# EAGLE design gps-harness (EAGLE 9.5.1)
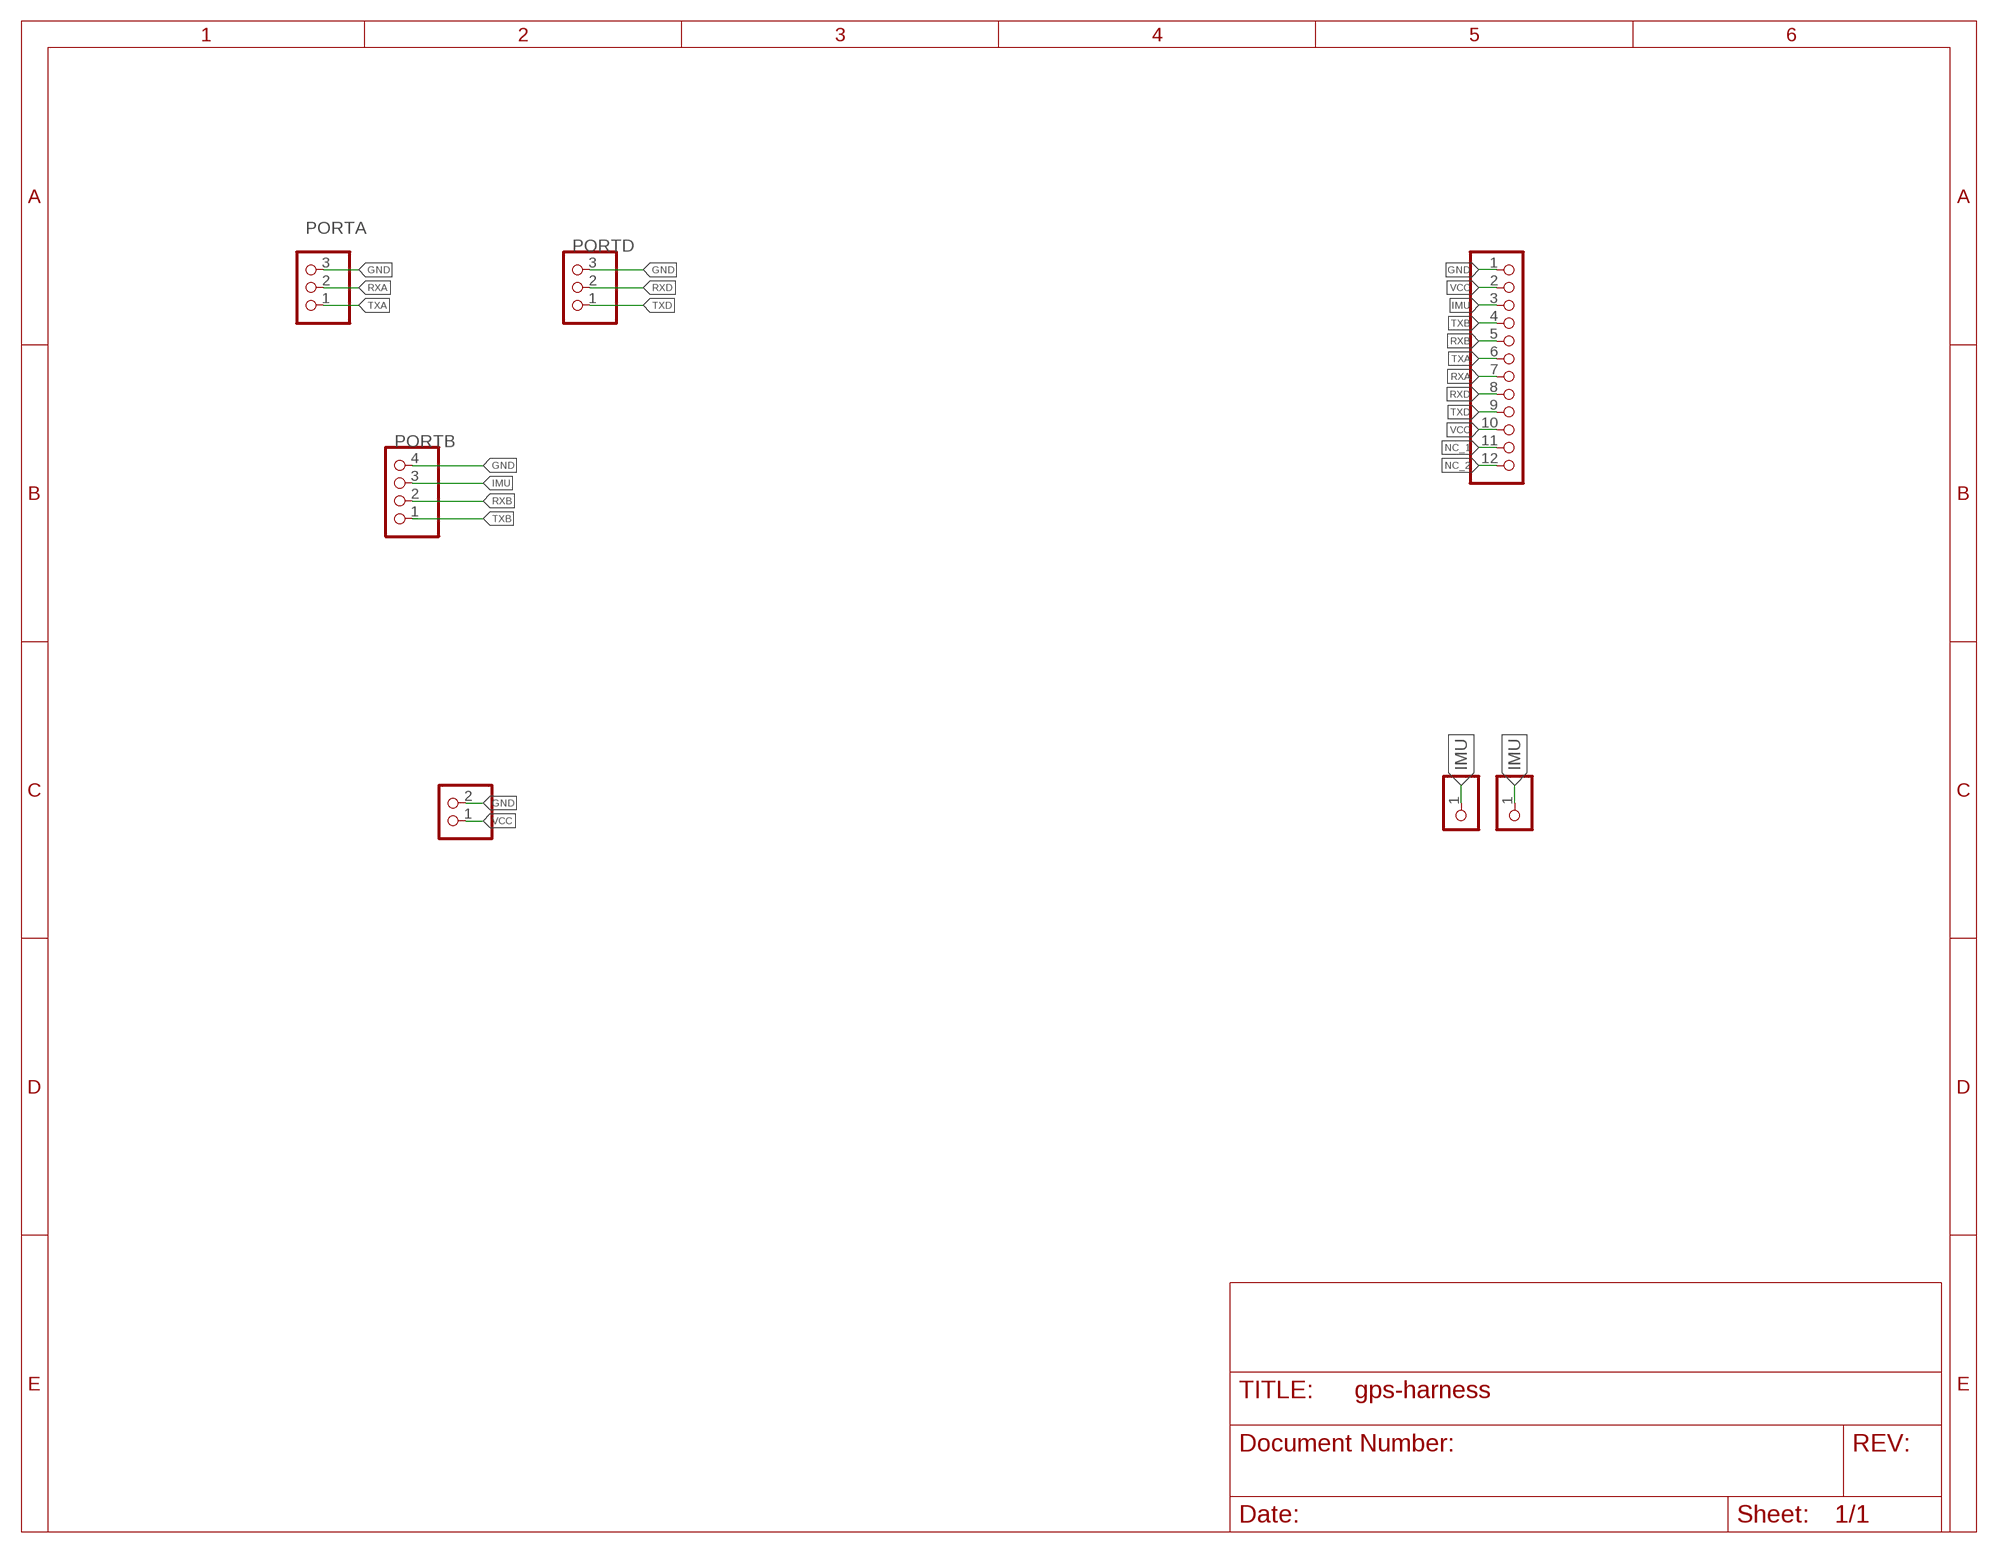
[diagram p0: schematic, sheet 1]

## Parts
BATTERY  PINHD-1X2  [1X02]
GPIO  PINHD-1X12  [1X12]
IMU  PINHD-1X1  [1X01]
PORTA  PINHD-1X3  [1X03]
PORTB  PINHD-1X4  [1X04]
PORTD  PINHD-1X3  [1X03]
TSY  PINHD-1X1  [1X01]

## Nets
GND: BATTERY.2 GPIO.1 PORTA.3 PORTB.4 PORTD.3
IMU: GPIO.3 IMU.1 PORTB.3 TSY.1
NC_1: GPIO.11
NC_2: GPIO.12
RXA: GPIO.7 PORTA.2
RXB: GPIO.5 PORTB.2
RXD: GPIO.8 PORTD.2
TXA: GPIO.6 PORTA.1
TXB: GPIO.4 PORTB.1
TXD: GPIO.9 PORTD.1
VCC: BATTERY.1 GPIO.2 GPIO.10

## Notes on the sheet
- PORTA
- PORTD
- PORTB

## Library data of the parts
BATTERY = pinhead:PINHD-1X2: PIN HEADER
GPIO = pinhead:PINHD-1X12: PIN HEADER
IMU TSY = pinhead:PINHD-1X1: PIN HEADER
PORTA PORTD = pinhead:PINHD-1X3: PIN HEADER
PORTB = pinhead:PINHD-1X4: PIN HEADER

## Board
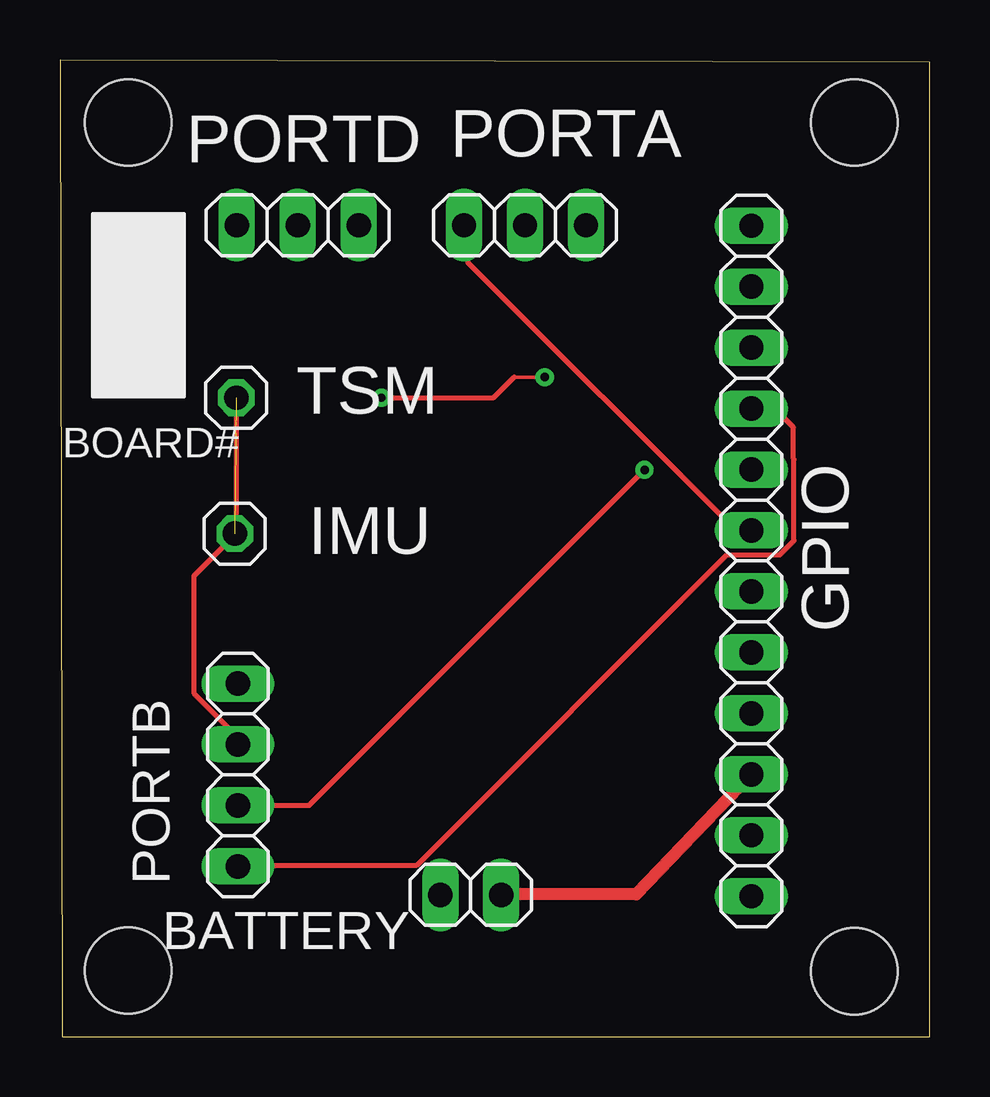
[diagram p1: board, top side]
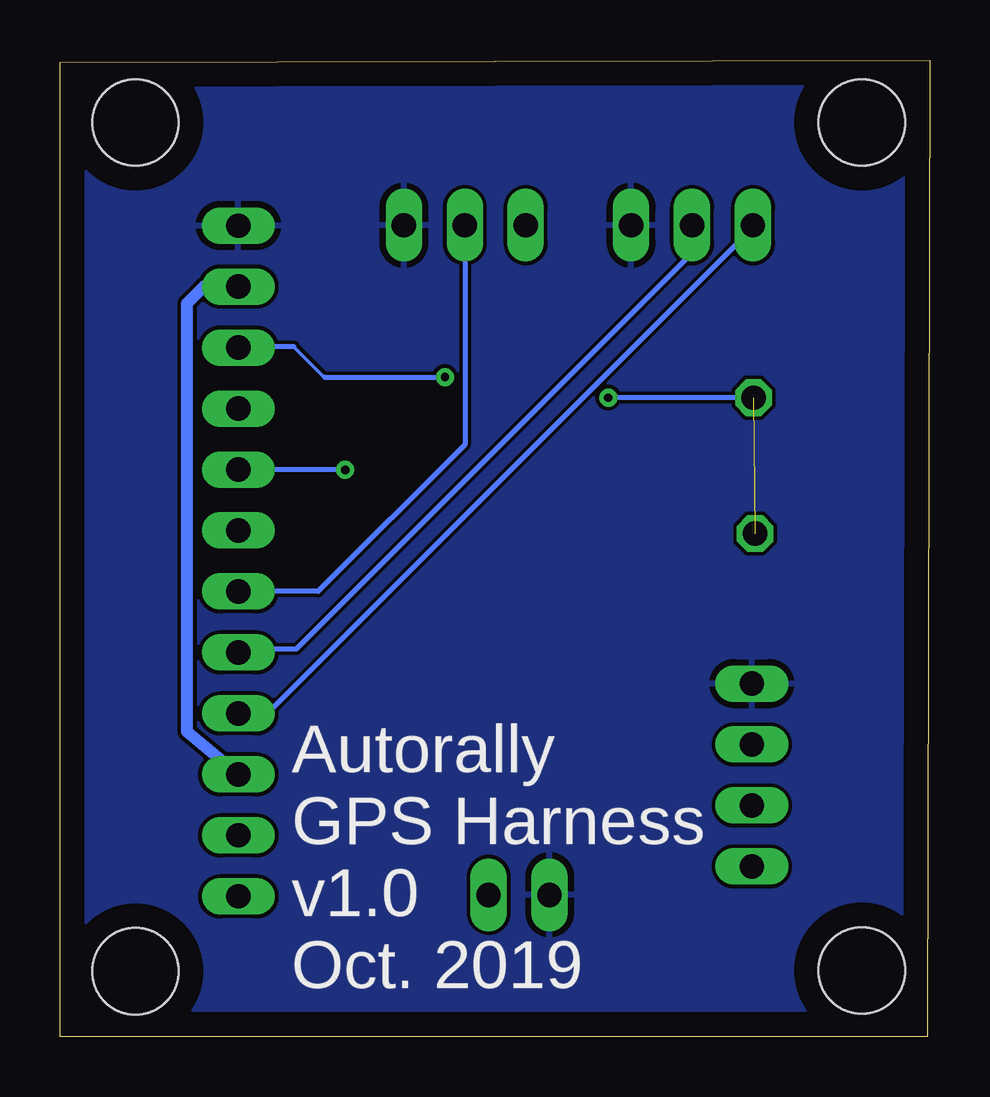
[diagram p2: board, bottom side, seen from below]

Size 36.26 x 40.71 mm. Coordinates in mm from the lower left corner, seen from the top.
Outline: 0.1,0 36.25,0.01 36.26,40.62 0,40.71 0.1,0
Copper layers (1*16): Top 0.035mm / dielectric 1.5mm / Bottom 0.035mm
Design rules "default": minimum track width 6mil, minimum drill 0.35mm, track to track 6mil, track to pad 6mil, pad to pad 6mil, via to via 6mil, smd to smd 6mil, copper to edge 40mil, drill to drill 6mil, minimum pad ring 10mil, minimum via ring 8mil, stop-mask expansion 4mil, vias tented up to drill 0mil, thermal gap 10mil
Holes 3.6 mm at 2.84,38.1 33.12,2.74 2.84,2.77 33.12,38.1

### Footprints (pad centres in the part's own frame; a part is rotated, then mirrored left to right if it is on the bottom)
1X02 = drill 1.016 long: 1 -1.27,0; 2 1.27,0
1X12 = drill 1.016 long: 1 -13.97,0; 2 -11.43,0; 3 -8.89,0; 4 -6.35,0; 5 -3.81,0; 6 -1.27,0; 7 1.27,0; 8 3.81,0; 9 6.35,0; 10 8.89,0; 11 11.43,0; 12 13.97,0
1X01 = drill 1.016 octagon: 1 0,0
1X03 = drill 1.016 long: 1 -2.54,0; 2 0,0; 3 2.54,0
1X04 = drill 1.016 long: 1 -3.81,0; 2 -1.27,0; 3 1.27,0; 4 3.81,0

### Placement (x,y rotation side)
BATTERY  17.12,5.92 180 top
GPIO  28.82,19.83 270 top
IMU  7.35,26.63 0 top
PORTA  19.39,33.82 0 top
PORTB  7.42,10.92 90 top
PORTD  9.91,33.82 0 top
TSY  7.28,20.97 0 top

### Tracks (layer width: path | path; a pad name or v marks a point on that pad's centre or on a via)
GND
  Bottom 0.152: 12.59,33.83 PORTD.3 | 21.89,33.83 PORTA.3 22.04,33.83 | 28.7,33.83 GPIO.1
  Bottom 0.5: PORTB.4 7.57,14.73
  pour Bottom: -1.17,41.91 -1.17,-1.27 38.2,-1.27 38.2,41.91
IMU  (via drill 0.35)  (1 unrouted)
  Top 0.152: 7.41,12.5 PORTB.3 | 18.94,27.49 v20.21,27.49
  Top 0.203: 7.41,12.5 5.58,14.33 5.58,19.2 7.35,20.97 IMU.1 | v13.4,26.63 18.08,26.63 18.94,27.49
  Bottom 0.152: v13.4,26.63 | 25.25,27.49 26.52,28.76 | 28.78,28.76 GPIO.3
  Bottom 0.203: IMU.1 v13.4,26.63 | 25.25,27.49 v20.21,27.49 | 26.52,28.76 28.78,28.76
RXA
  Bottom 0.203: PORTA.2 19.39,24.67 25.49,18.56 GPIO.7
RXB  (via drill 0.35)
  Top 0.152: v24.37,23.63 | v24.37,23.63
  Top 0.203: PORTB.2 10.39,9.65 v24.37,23.63
  Bottom 0.152: 28.81,23.63 GPIO.5
  Bottom 0.203: v24.37,23.63 28.81,23.63
RXD
  Bottom 0.152: 28.7,16.15 GPIO.8 | 9.91,32.65 PORTD.2
  Bottom 0.203: 28.7,16.15 26.41,16.15 9.91,32.65
TXA
  Top 0.203: GPIO.6 28.17,21.1 17.01,32.26 PORTA.1
TXB
  Top 0.152: 7.56,7.16 PORTB.1
  Top 0.203: 7.56,7.16 14.88,7.16 27.8,20.09 30.01,20.09 30.6,20.68 30.6,24.06 30.58,24.09 30.58,25.4 29.79,26.18 GPIO.4
TXD
  Bottom 0.152: 28.7,13.56 GPIO.9 | 7.41,33.68 PORTD.1
  Bottom 0.203: 28.7,13.56 27.53,13.56 7.41,33.68
VCC
  Top 0.152: 18.54,5.94 BATTERY.1
  Top 0.5: 18.54,5.94 24.03,5.94 GPIO.10
  Bottom 0.5: GPIO.2 30.26,31.26 30.96,30.56 30.96,12.72 GPIO.10

### Text on the board
tPlace: PORTD | PORTA | TSM | BOARD# | IMU | GPIO | PORTB | BATTERY
bPlace: Autorally / GPS Harness / v1.0 / Oct. 2019